# Altium schematic sheet PIFWRobot.SchDoc
size A3
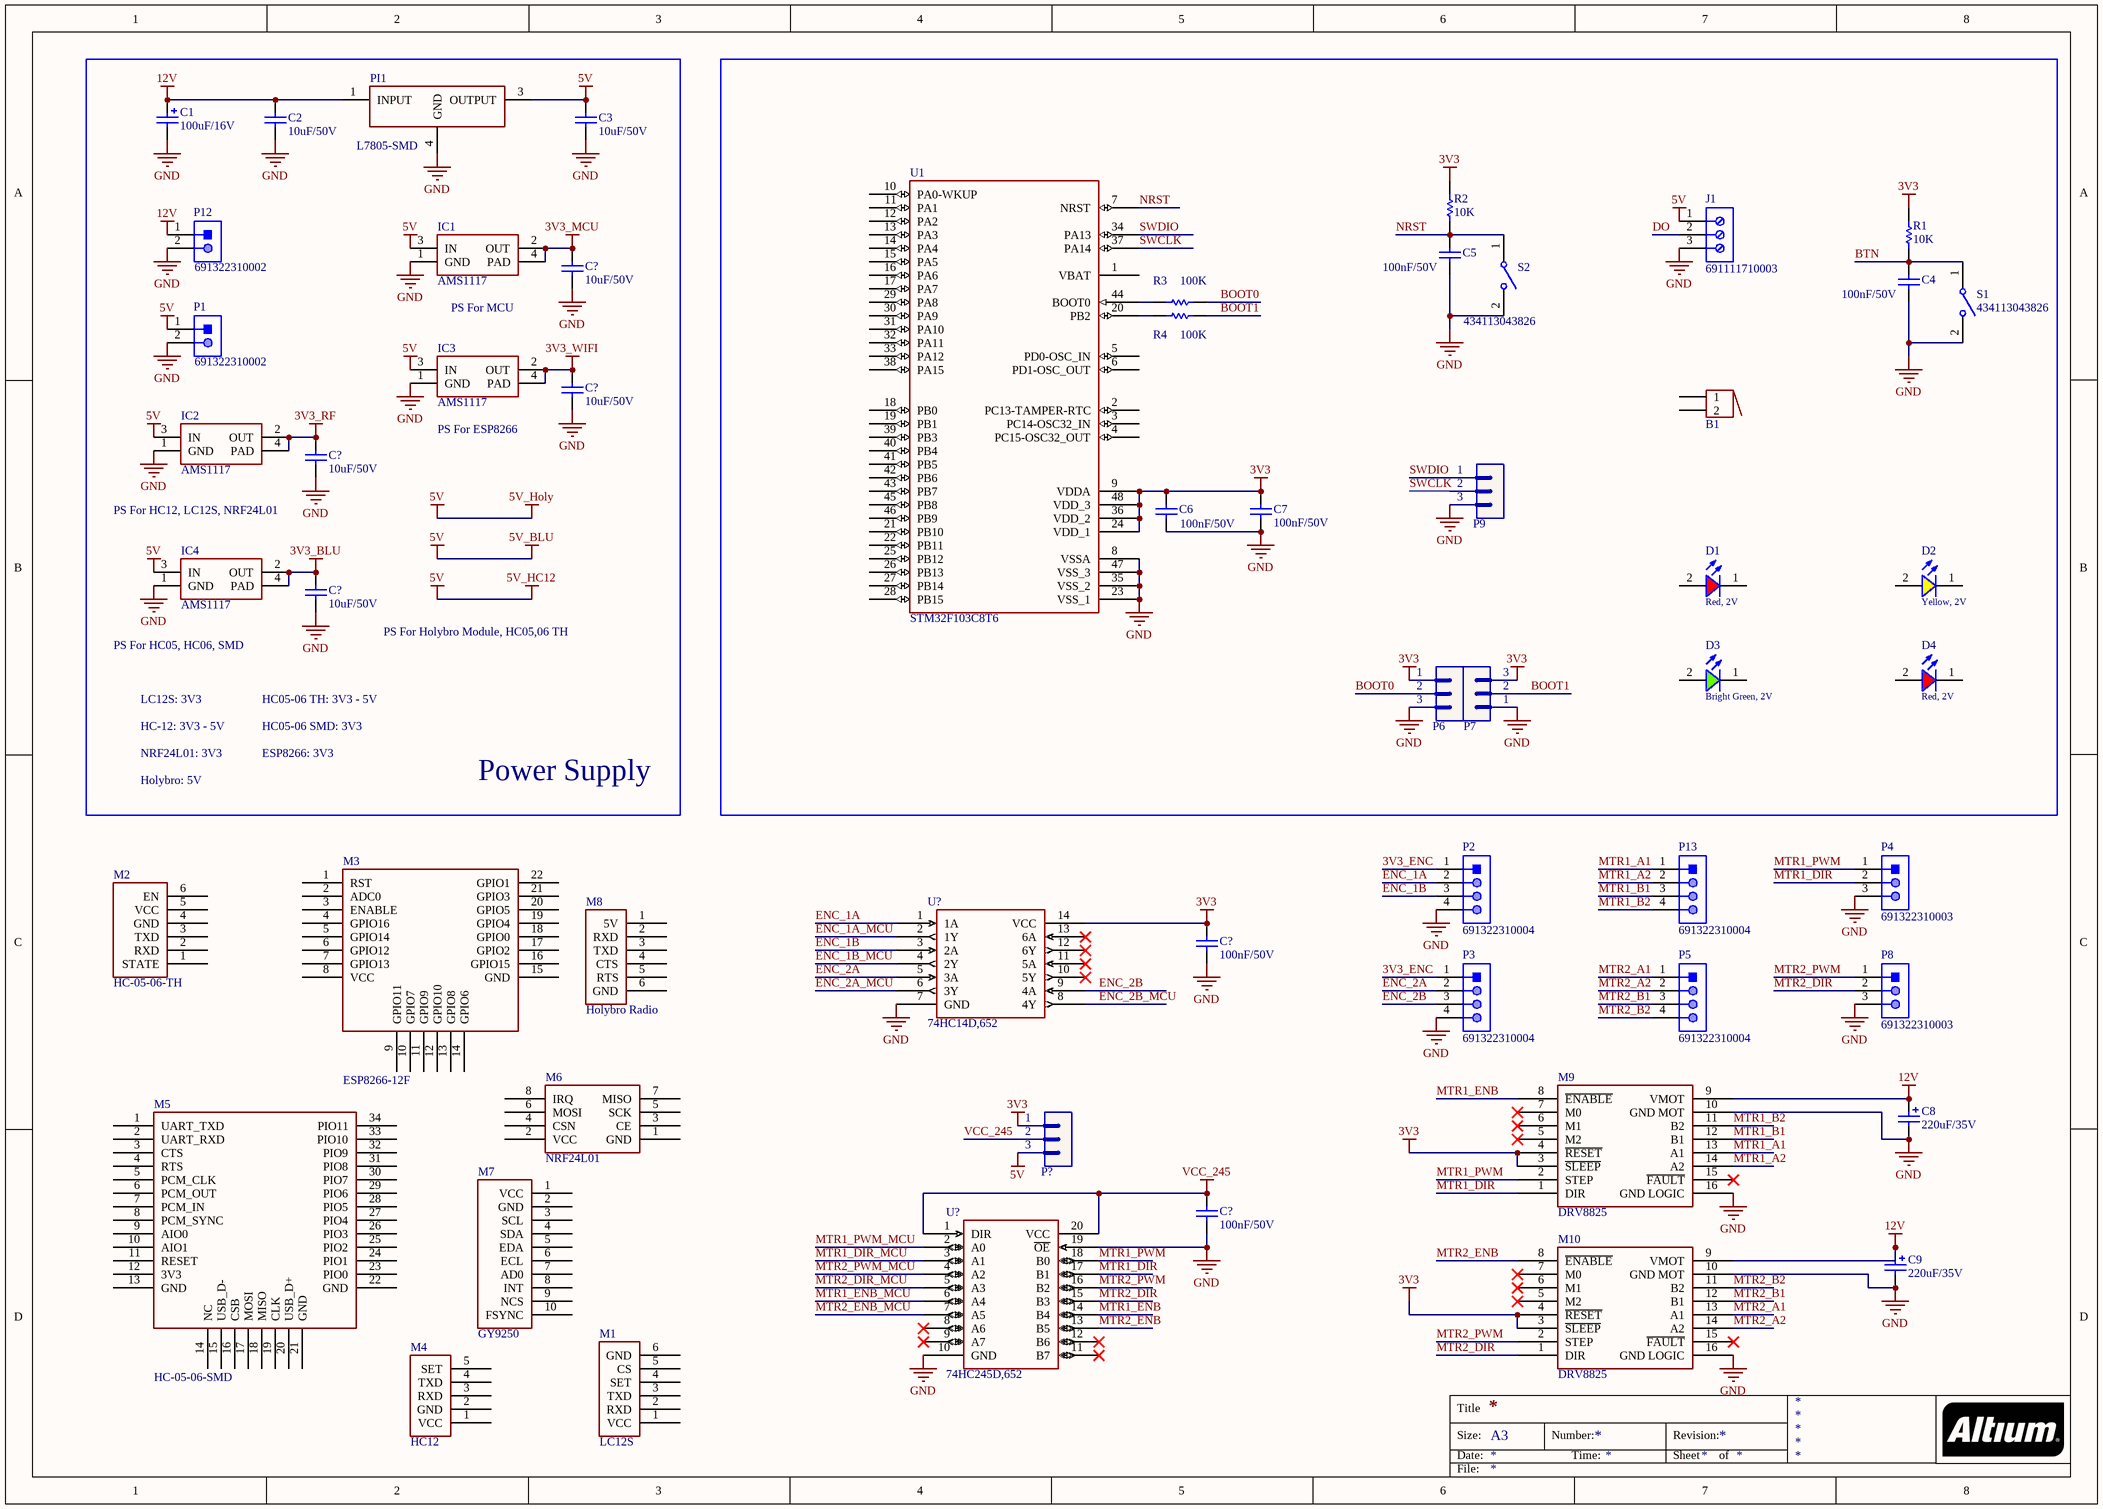
[diagram p0: PIFWRobot.SchDoc]

## Parts
(Parts that share a designator on the sheet are numbered #1, #2 ... from top to bottom, then left to right.)
B1  Buzzer  [BUZZER]  (value not drawn)
C1  value 100uF/16V  [CAP-SM-AL-SIZE-D-D6L6]  (hidden comment: Cap-Al-100uF-16V-D6L5)
C2  value 10uF/50V  [CAP-SM-0805]  (hidden comment: Cap-10uF-50V-0805)
C3  value 10uF/50V  [CAP-SM-0805]  (hidden comment: Cap-10uF-50V-0805)
C4  value 100nF/50V  [CAP-SM-0805]  (hidden comment: Cap-100nF-50V-0805)
C5  value 100nF/50V  [CAP-SM-0805]  (hidden comment: Cap-100nF-50V-0805)
C6  value 100nF/50V  [CAP-SM-0805]  (hidden comment: Cap-100nF-50V-0805)
C7  value 100nF/50V  [CAP-SM-0805]  (hidden comment: Cap-100nF-50V-0805)
C8  value 220uF/35V  [CAP-SM-AL-SIZE-F-D8L10]  (hidden comment: Cap-Al-220uF-35V-D8L10)
C9  value 220uF/35V  [CAP-SM-AL-SIZE-F-D8L10]  (hidden comment: Cap-Al-220uF-35V-D8L10)
C?#1  value 10uF/50V  [CAP-SM-0805]  (hidden comment: Cap-10uF-50V-0805)
C?#2  value 10uF/50V  [CAP-SM-0805]  (hidden comment: Cap-10uF-50V-0805)
C?#3  value 10uF/50V  [CAP-SM-0805]  (hidden comment: Cap-10uF-50V-0805)
C?#4  value 10uF/50V  [CAP-SM-0805]  (hidden comment: Cap-10uF-50V-0805)
C?#5  value 100nF/50V  [CAP-SM-0805]  (hidden comment: Cap-100nF-50V-0805)
C?#6  value 100nF/50V  [CAP-SM-0805]  (hidden comment: Cap-100nF-50V-0805)
D1  Red, 2V  [WL-SMCW_0805]
D2  Yellow, 2V  [WL-SMCW_0805]
D3  Bright Green, 2V  [WL-SMCW_0805]
D4  Red, 2V  [WL-SMCW_0805]
IC1  AMS1117  [SOT223]
IC2  AMS1117  [SOT223]
IC3  AMS1117  [SOT223]
IC4  AMS1117  [SOT223]
J1  691111710003  [691111710003]
M1  LC12S  [LC12S]
M2  HC-05-06-TH  [HC-05-06-TH]
M3  ESP8266-12F  [ESP8266-12F]
M4  HC12  [HC12]
M5  HC-05-06-SMD  [HC-05-06-SMD]
M6  NRF24L01  [NRF24L01]
M7  GY9250  [GY9250]
M8  Holybro Radio  [HOLYBRO-RADIO]
M9  DRV8825  [DRV8825]
M10  DRV8825  [DRV8825]
P1  691322310002  [691322310002]
P2  691322310004  [691322310004]
P3  691322310004  [691322310004]
P4  691322310003  [691322310003]
P5  691322310004  [691322310004]
P6  Header 3  [JP3]  (value not drawn)
P7  Header 3  [JP3]  (value not drawn)
P8  691322310003  [691322310003]
P9  Header 3  [JP3]  (value not drawn)
P12  691322310002  [691322310002]
P13  691322310004  [691322310004]
P?  Header 3  [JP3]  (value not drawn)
PI1  L7805-SMD  [TO254P1435X464-4N]
R1  value 10K  [RES-SM-0805]  (hidden comment: Res-10k-0805)
R2  value 10K  [RES-SM-0805]  (hidden comment: Res-10k-0805)
R3  value 100K  [RES-SM-0805]  (hidden comment: Res-100K-0805)
R4  value 100K  [RES-SM-0805]  (hidden comment: Res-100K-0805)
S1  434113043826  [434113043826]
S2  434113043826  [434113043826]
U1  STM32F103C8T6  [LQFP-48]
U?#1  74HC14D,652  [SOT108-1_NEX]
U?#2  74HC245D,652  [SOT163-1_NEX]

## Blocks framed on the sheet
Power Supply: C1-C3 C?#1-C?#4 IC1-IC4 P1 P12 PI1

## Nets
3V3: C6.2 C7.2 C?#5.2 M9.3(~{SLEEP}) M9.4(~{RESET}) M10.3(~{SLEEP}) M10.4(~{RESET}) P6.1 P7.3 P?.1 R1.2 R2.2 U1.9(VDDA) U1.24(VDD_1) U1.36(VDD_2) U1.48(VDD_3) U?#1.14(VCC)
3V3_BLU: C?#4.2 IC4.2(OUT) IC4.4(PAD)
3V3_MCU: C?#1.2 IC1.2(OUT) IC1.4(PAD)
3V3_RF: C?#3.2 IC2.2(OUT) IC2.4(PAD)
3V3_WIFI: C?#2.2 IC3.2(OUT) IC3.4(PAD)
5V: C3.2 IC1.3(IN) IC2.3(IN) IC3.3(IN) IC4.3(IN) J1.1 P1.1 P?.3 PI1.3(OUTPUT)  [also labelled 5V_BLU, 5V_HC12, 5V_Holy]
12V: C1.1 C2.2 C8.1 C9.1 M9.9(VMOT) M10.9(VMOT) P12.1 PI1.1(INPUT)
GND: C1.2 C2.1 C3.1 C4.1 C5.1 C6.1 C7.1 C8.2 C9.2 C?#1.1 C?#2.1 C?#3.1 C?#4.1 C?#5.1 C?#6.1 IC1.1(GND) IC2.1(GND) IC3.1(GND) IC4.1(GND) J1.3 M9.10(GND_MOT) M9.16(GND_LOGIC) M10.10(GND_MOT) M10.16(GND_LOGIC) P1.2 P2.4 P3.4 P4.3 P6.3 P7.1 P8.3 P9.3 P12.2 PI1.4(GND) S1.2 S2.2 U1.8(VSSA) U1.23(VSS_1) U1.35(VSS_2) U1.47(VSS_3) U?#1.7(GND) U?#2.10(GND) U?#2.19(~{OE})
VCC_245: C?#6.2 P?.2 U?#2.1(DIR) U?#2.20(VCC)
3V3_ENC: P2.1 P3.1
BOOT0: P6.2 R3.2
BOOT1: P7.2 R4.1
BTN: C4.2 R1.1 S1.1
DO: J1.2
ENC_1A: P2.2 U?#1.1(1A)
ENC_1A_MCU: U?#1.2(1Y)
ENC_1B: P2.3 U?#1.3(2A)
ENC_1B_MCU: U?#1.4(2Y)
ENC_2A: P3.2 U?#1.5(3A)
ENC_2A_MCU: U?#1.6(3Y)
ENC_2B: P3.3 U?#1.9(4A)
ENC_2B_MCU: U?#1.8(4Y)
MTR1_A1: M9.13(A1) P13.1
MTR1_A2: M9.14(A2) P13.2
MTR1_B1: M9.12(B1) P13.3
MTR1_B2: M9.11(B2) P13.4
MTR1_DIR: M9.1(DIR) P4.2 U?#2.17(B1)
MTR1_DIR_MCU: U?#2.3(A1)
MTR1_ENB: M9.8(~{ENABLE}) U?#2.14(B4)
MTR1_ENB_MCU: U?#2.6(A4)
MTR1_PWM: M9.2(STEP) P4.1 U?#2.18(B0)
MTR1_PWM_MCU: U?#2.2(A0)
MTR2_A1: M10.13(A1) P5.1
MTR2_A2: M10.14(A2) P5.2
MTR2_B1: M10.12(B1) P5.3
MTR2_B2: M10.11(B2) P5.4
MTR2_DIR: M10.1(DIR) P8.2 U?#2.15(B3)
MTR2_DIR_MCU: U?#2.5(A3)
MTR2_ENB: M10.8(~{ENABLE}) U?#2.13(B5)
MTR2_ENB_MCU: U?#2.7(A5)
MTR2_PWM: M10.2(STEP) P8.1 U?#2.16(B2)
MTR2_PWM_MCU: U?#2.4(A2)
NRST: C5.2 R2.1 S2.1 U1.7(NRST)
SWCLK: P9.2 U1.37(PA14)
SWDIO: P9.1 U1.34(PA13)
NetR3_1: R3.1 U1.44(BOOT0)
NetR4_2: R4.2 U1.20(PB2)

Not connected (* = marked no-connect by the designer): B1 1 2; D1 1(K) 2(A); D2 1(K) 2(A); D3 1(K) 2(A); D4 1(K) 2(A); M1 1(VCC) 2(RXD) 3(TXD) 4(SET) 5(CS) 6(GND); M2 1(STATE) 2(RXD) 3(TXD) 4(GND) 5(VCC) 6(EN); M3 1(RST) 2(ADC0) 3(ENABLE) 4(GPIO16) 5(GPIO14) 6(GPIO12) 7(GPIO13) 8(VCC) 9(GPIO11) 10(GPIO7) 11(GPIO9) 12(GPIO10) 13(GPIO8) 14(GPIO6) 15(GND) 16(GPIO15) 17(GPIO2) 18(GPIO0) 19(GPIO4) 20(GPIO5) 21(GPIO3) 22(GPIO1); M4 1(VCC) 2(GND) 3(RXD) 4(TXD) 5(SET); M5 1(UART_TXD) 2(UART_RXD) 3(CTS) 4(RTS) 5(PCM_CLK) 6(PCM_OUT) 7(PCM_IN) 8(PCM_SYNC) 9(AIO0) 10(AIO1) 11(RESET) 12(3V3) 13(GND) 14(NC) 15(USB_D-) 16(CSB) 17(MOSI) 18(MISO) 19(CLK) 20(USB_D+) 21(GND) 22(GND) 23(PIO0) 24(PIO1) 25(PIO2) 26(PIO3) 27(PIO4) 28(PIO5) 29(PIO6) 30(PIO7) 31(PIO8) 32(PIO9) 33(PIO10) 34(PIO11); M6 1(GND) 2(VCC) 3(CE) 4(CSN) 5(SCK) 6(MOSI) 7(MISO) 8(IRQ); M7 1(VCC) 2(GND) 3(SCL) 4(SDA) 5(EDA) 6(ECL) 7(AD0) 8(INT) 9(NCS) 10(FSYNC); M8 1(5V) 2(RXD) 3(TXD) 4(CTS) 5(RTS) 6(GND); M9 5(M2)* 6(M1)* 7(M0)* 15(~{FAULT})*; M10 5(M2)* 6(M1)* 7(M0)* 15(~{FAULT})*; U1 1(VBAT) 2(PC13-TAMPER-RTC) 3(PC14-OSC32_IN) 4(PC15-OSC32_OUT) 5(PD0-OSC_IN) 6(PD1-OSC_OUT) 10(PA0-WKUP) 11(PA1) 12(PA2) 13(PA3) 14(PA4) 15(PA5) 16(PA6) 17(PA7) 18(PB0) 19(PB1) 21(PB10) 22(PB11) 25(PB12) 26(PB13) 27(PB14) 28(PB15) 29(PA8) 30(PA9) 31(PA10) 32(PA11) 33(PA12) 38(PA15) 39(PB3) 40(PB4) 41(PB5) 42(PB6) 43(PB7) 45(PB8) 46(PB9); U?#1 10(5Y)* 11(5A)* 12(6Y)* 13(6A)*; U?#2 8(A6)* 9(A7)* 11(B7)* 12(B6)*

## Notes on the sheet
- PS For MCU
- PS For ESP8266
- PS For HC12, LC12S, NRF24L01
- PS For HC05, HC06, SMD
- PS For Holybro Module, HC05,06 TH
- LC12S: 3V3
- HC05-06 TH: 3V3 - 5V
- HC-12: 3V3 - 5V
- NRF24L01: 3V3
- Holybro: 5V
- HC05-06 SMD: 3V3
- ESP8266: 3V3
- Title
- Size:
- Date:
- A3
- Number:
- Time:
- Revision:
- Sheet
- of
- File:

## Library data of the parts
C1 = Cap-Al-100uF-16V-D6L5: CAP ALUM 100UF 20% 16V SMD; Manufacturer: Nichicon; Manufacturer Part Number: UWX1C101MCL1GB; Local Supplier: thegioiic; Local Supplier Link: https://thegioiic.com/products/tu-nhom-smd-100uf-16v-d6-3l5-4; Supplier 1: Digikey; Supplier 1 Part Number: 493-2105-1-ND; Supplier 1 Link: https://www.digikey.com/product-detail/en/nichicon/UWX1C101MCL1GB/493-2105-1-ND/590080
C2 C3 C?#1-C?#4 = Cap-10uF-50V-0805: CAP CER 10UF 50V X5R 0805; Manufacturer: Yageo; Manufacturer Part Number: CC0805KKX5R9BB106; Local Supplier: thegioiic; Local Supplier Link: https://thegioiic.com/products/tu-10uf-50v-0805; Supplier 1: Digikey; Supplier 1 Link: https://www.digikey.com/product-detail/en/yageo/CC0805KKX5R9BB106/311-3499-2-ND/7164383; Supplier 1 Part Number: 311-3499-2-ND
C4-C7 C?#5 C?#6 = Cap-100nF-50V-0805: CAP CER 0.1UF 50V Y5V 0805; Manufacturer: Samsung Electro-Mechanics; Manufacturer Part Number: CL21F104ZBCNNNC; Local Supplier: thegioiic; Local Supplier Link: https://thegioiic.com/products/tu-100nf-0-1uf-50v-0805; Supplier 1: Digikey; Supplier 1 Part Number: 1276-1007-1-ND; Supplier 1 Link: https://www.digikey.com/product-detail/en/samsung-electro-mechanics/CL21F104ZBCNNNC/1276-1007-1-ND/3889093
C8 C9 = Cap-Al-220uF-35V-D8L10: CAP ALUM 220UF 20% 35V SMD; Manufacturer: Nichicon; Manufacturer Part Number: UWT1V221MNL1GS; Local Supplier: thegioiic; Local Supplier Link: https://thegioiic.com/products/tu-nhom-smd-220uf-35v-d8l10; Supplier 1: Digikey; Supplier 1 Link: https://www.digikey.com/product-detail/en/nichicon/UWT1V221MNL1GS/493-2205-2-ND/589946; Supplier 1 Part Number: 493-2205-2-ND
D1 D4 = 150080RS75000: WL-SMCW SMT Mono-color Chip LED Waterclear, size 0805, Red, 2V, 140deg; Chip Technology: AlInGaP; Dominant Wavelength typ.: 625nm; Luminous Intensity typ.: 150mcd; Peak Wavelength typ.: 630nm; Viewing Angle: 140deg; ComponentLink1Description: Manufacturer; ComponentLink1URL: http://www.we-online.de; ComponentLink2URL: https://www.we-online.com/catalog/datasheet/150080RS75000.pdf; ComponentLink2Description: Datasheet; Forward Voltage typ.: 2V; Emitting Color: Red; Mounting Technology: SMT; Operating Temperature: -40 to +85degC; Published Date: December 2019; Part Number: 150080RS75000; Packaging: Tape and Reel; Size: 0805; Publisher: Wurth Elektronik
D2 = 150080YS75000: WL-SMCW SMT Mono-color Chip LED Waterclear, size 0805, Yellow, 2V, 140deg; Chip Technology: AlInGaP; Dominant Wavelength typ.: 590nm; Luminous Intensity typ.: 120mcd; Peak Wavelength typ.: 595nm; Viewing Angle: 140deg; ComponentLink1Description: Manufacturer; ComponentLink1URL: http://www.we-online.de; ComponentLink2URL: https://www.we-online.com/catalog/datasheet/150080YS75000.pdf; ComponentLink2Description: Datasheet; Forward Voltage typ.: 2V; Emitting Color: Yellow; Mounting Technology: SMT; Operating Temperature: -40 to +85degC; Published Date: December 2019; Part Number: 150080YS75000; Packaging: Tape and Reel; Size: 0805; Publisher: Wurth Elektronik
D3 = 150080VS75000: WL-SMCW SMT Mono-color Chip LED Waterclear, size 0805, Bright Green, 2V, 140deg; Chip Technology: AlInGaP; Dominant Wavelength typ.: 570nm; Luminous Intensity typ.: 40mcd; Peak Wavelength typ.: 572nm; Viewing Angle: 140deg; ComponentLink1Description: Manufacturer; ComponentLink1URL: http://www.we-online.de; ComponentLink2URL: https://www.we-online.com/catalog/datasheet/150080VS75000.pdf; ComponentLink2Description: Datasheet; Forward Voltage typ.: 2V; Emitting Color: Bright Green; Mounting Technology: SMT; Operating Temperature: -40 to +85degC; Published Date: December 2019; Part Number: 150080VS75000; Packaging: Tape and Reel; Size: 0805; Publisher: Wurth Elektronik
IC1-IC4 = AMS1117: Available in 1.8V, 2.5V, 2.85V, 3.3V, 5V, and  Adjustable Versions; Value: LM317
J1 = 691111710003: WR-TBL Serie 111 Horizontal Entry Modular, Pressure Clamp, pitch 5mm, 3p; Compliance: Lead free / RoHS; Modularity: Yes; PCB/Cable/Panel: PCB; Pin Number: 3; Rated Current [UL]: 15A; Working Voltage [UL]: 250VAC; ComponentLink1Description: Manufacturer; ComponentLink1URL: http://www.we-online.de; ComponentLink2URL: https://katalog.we-online.de/em/datasheet/691111710003.pdf; ComponentLink2Description: Datasheet; Mounting Technology: THT; Part Number: 691111710003; Packaging: Box; Operating Temperature: -40 to +105degC; Pitch: 5mm; Published Date: October 2019; Type: Horizontal; Publisher: Wurth Elektronik; Application: Pressure Clamp
P1 P12 = 691322310002: WR-TBL Serie 322 Horizontal PCB Header, Pluggable, pitch 3.81mm, 2p; Compliance: RoHS; Modularity: No; Pin Number: 2; Rated Current [UL]: 10A; Working Voltage [UL]: 300VAC; ComponentLink1Description: Manufacturer; ComponentLink1URL: http://www.we-online.de; ComponentLink2URL: https://katalog.we-online.de/em/datasheet/691322310002.pdf; ComponentLink2Description: Datasheet; Mounting Technology: THT; Part Number: 691322310002; Packaging: Box; Operating Temperature: -40 to +105degC; PCB/Cable/Panel: PCB; Pitch: 3.81mm; Published Date: October 2019; Type: Horizontal; Publisher: Wurth Elektronik; Application: Pluggable
P2 P3 P5 P13 = 691322310004: WR-TBL Serie 322 Horizontal PCB Header, Pluggable, pitch 3.81mm, 4p; Compliance: RoHS; Modularity: No; Pin Number: 4; Rated Current [UL]: 10A; Working Voltage [UL]: 300VAC; ComponentLink1Description: Manufacturer; ComponentLink1URL: http://www.we-online.de; ComponentLink2URL: https://katalog.we-online.de/em/datasheet/691322310004.pdf; ComponentLink2Description: Datasheet; Mounting Technology: THT; Part Number: 691322310004; Packaging: Box; Operating Temperature: -40 to +105degC; PCB/Cable/Panel: PCB; Pitch: 3.81mm; Published Date: October 2019; Type: Horizontal; Publisher: Wurth Elektronik; Application: Pluggable
P4 P8 = 691322310003: WR-TBL Serie 322 Horizontal PCB Header, Pluggable, pitch 3.81mm, 3p; Compliance: RoHS; Modularity: No; Pin Number: 3; Rated Current [UL]: 10A; Working Voltage [UL]: 300VAC; ComponentLink1Description: Manufacturer; ComponentLink1URL: http://www.we-online.de; ComponentLink2URL: https://katalog.we-online.de/em/datasheet/691322310003.pdf; ComponentLink2Description: Datasheet; Mounting Technology: THT; Part Number: 691322310003; Packaging: Box; Operating Temperature: -40 to +105degC; PCB/Cable/Panel: PCB; Pitch: 3.81mm; Published Date: October 2019; Type: Horizontal; Publisher: Wurth Elektronik; Application: Pluggable
P6 P7 P9 P? = Header 3: Header, 3-Pin; LatestRevisionDate: 17-Jul-2002; LatestRevisionNote: Re-released for DXP Platform.; Publisher: Altium Limited
R1 R2 = Res-10k-0805: RES 10K OHM 1% 1/4W 0805; Manufacturer: Stackpole Electronics Inc; Manufacturer Part Number: RNCP0805FTD10K0; Local Supplier: thegioiic; Local Supplier Link: https://thegioiic.com/products/dien-tro-10k-ohm-0805-5; Supplier 1: Digikey; Supplier 1 Link: https://www.digikey.com/product-detail/en/stackpole-electronics-inc/RNCP0805FTD10K0/RNCP0805FTD10K0CT-ND/2240601; Supplier 1 Part Number: RNCP0805FTD10K0CT-ND
R3 R4 = Res-100K-0805: RES 0 OHM JUMPER 0805; Manufacturer: Vishay Dale; Manufacturer Part Number: WSL080500000ZEA9; Local Supplier: thegioiic; Local Supplier Link: https://thegioiic.com/products/dien-tro-0-ohm-0805-5; Supplier 1: Digikey; Supplier 1 Link: https://www.digikey.com/product-detail/en/vishay-dale/WSL080500000ZEA9/541-3928-1-ND/7423223; Supplier 1 Part Number: 541-3928-1-ND
S1 S2 = 434113043826: WS-TASV J-Bend SMT Tact Switch 6x3.5mm, height 4.3mm, 260gf; Rated Voltage: 12VDC; Rated Current: 50mA; Washable: No; ComponentLink1Description: Manufacturer; ComponentLink1URL: http://www.we-online.de; ComponentLink2Description: Datasheet; ComponentLink2URL: https://katalog.we-online.com/em/datasheet/434113043826.pdf; Operating Temperature: -40 to +85degC; Part Number: 434113043826; Published Date: September 2019; Contact Material: Stainless Steel; Height: 4.3mm; Mounting Technology: SMT; Contact Plating: Silver; Operation Force: 260gf; Packaging: Tape and Reel; Terminal Material: Copper Alloy; Publisher: Wurth Elektronik; Terminal Plating: Silver
U1 = STM32F103C8T6: Manufacturer: ST Electronic; Manufacture Part Number: STM32F103C8T6; Local Supplier: TME; Local Supplier Part Number: STM32F103C8T6; Local Supplier Link: http://www.tme.vn/Product.aspx?id=1711#page=pro_info
U?#1 = 74HC14D,652: No Description Available; Vendor: Nexperia; SourceLibrary: Nexperia_2018-05-2018; Manufacturer_Part_Number: 74HC14D,652; Copyright: Copyright (C) 2016 Accelerated Designs. All rights reserved; RefDes: RefDes; Type: DEV; Value: Value
U?#2 = 74HC245D,652: No Description Available; Vendor: Nexperia; SourceLibrary: Nexperia_2018-05-2018; Manufacturer_Part_Number: 74HC245D,652; Copyright: Copyright (C) 2016 Accelerated Designs. All rights reserved; RefDes: RefDes; Type: DEV
M1 = LC12S: Manufacturer: *; Manufacturer Part Number: *; Local Supplier: HShop; Local Supplier Link: https://hshop.vn/products/mach-thu-phat-rf-uart-lc12s-2-4ghz; Local Supplier Part Number: HS000895
M2 = HC-05-06-TH: Manufacturer: *; Manufacturer Part Number: *; Local Supplier: HShop; Local Supplier Part Numer: HS000882; Local Supplier Link: https://hshop.vn/products/mach-thu-phat-bluetooth-hc-05-do-ra-chon-master
M3 = ESP8266-12F: Manufacturer: *; Manufacturer Part Number: *; Local Supplier: HShop; Local Supplier Link: https://hshop.vn/products/mach-thu-phat-wifi-soc-esp8266-v12; Local Supplier Part Number: HS000912
M4 = HC12: Manufacturer: *; Manufacturer Part Number: *; Local Supplier: HShop; Local Supplier Link: https://hshop.vn/products/mach-thu-phat-rf-uart-si4463-433mhzkhoang-coch-1km; Local Supplier Part Number: HS000897
M5 = HC-05-06-SMD: Manufacturer: *; Manufacturer Part Number: *; Local Supplier: HShop; Local Supplier Part Numer: HS000881; Local Supplier Link: https://hshop.vn/products/mach-thu-phat-bluetooth-hc-05-chua-ra-chon-master
M6 = NRF24L01: Local Supplier: HShop; Local Supplier Part Number: HS000888; Manufacturer: *; Manufactuere Part Number: *; Local Supplier Link: https://hshop.vn/products/mach-thu-phat-nrf24l01-pa-2-4ghzcu-khech-dai-cung-suat-thu-phat
M8 = Holybro Radio: Supplier: *; Supplier Part Number: *; Manufacturer: *; Manufacturer Part Number: *; Supplier Link: https://www.lazada.vn/products/ld-holybro-433mhz-915-mhz-500-mw-thu-phat-vo-tuyen-xa-bo-v3-cho-pixhawk-4-dieu-khien-chuyen-bay-i430804435-s768474304.html?spm=a2o4n.searchlist.list.4.25396b19yIS9XO&search=1